# EAGLE design Esquematico (EAGLE 9.6.2)
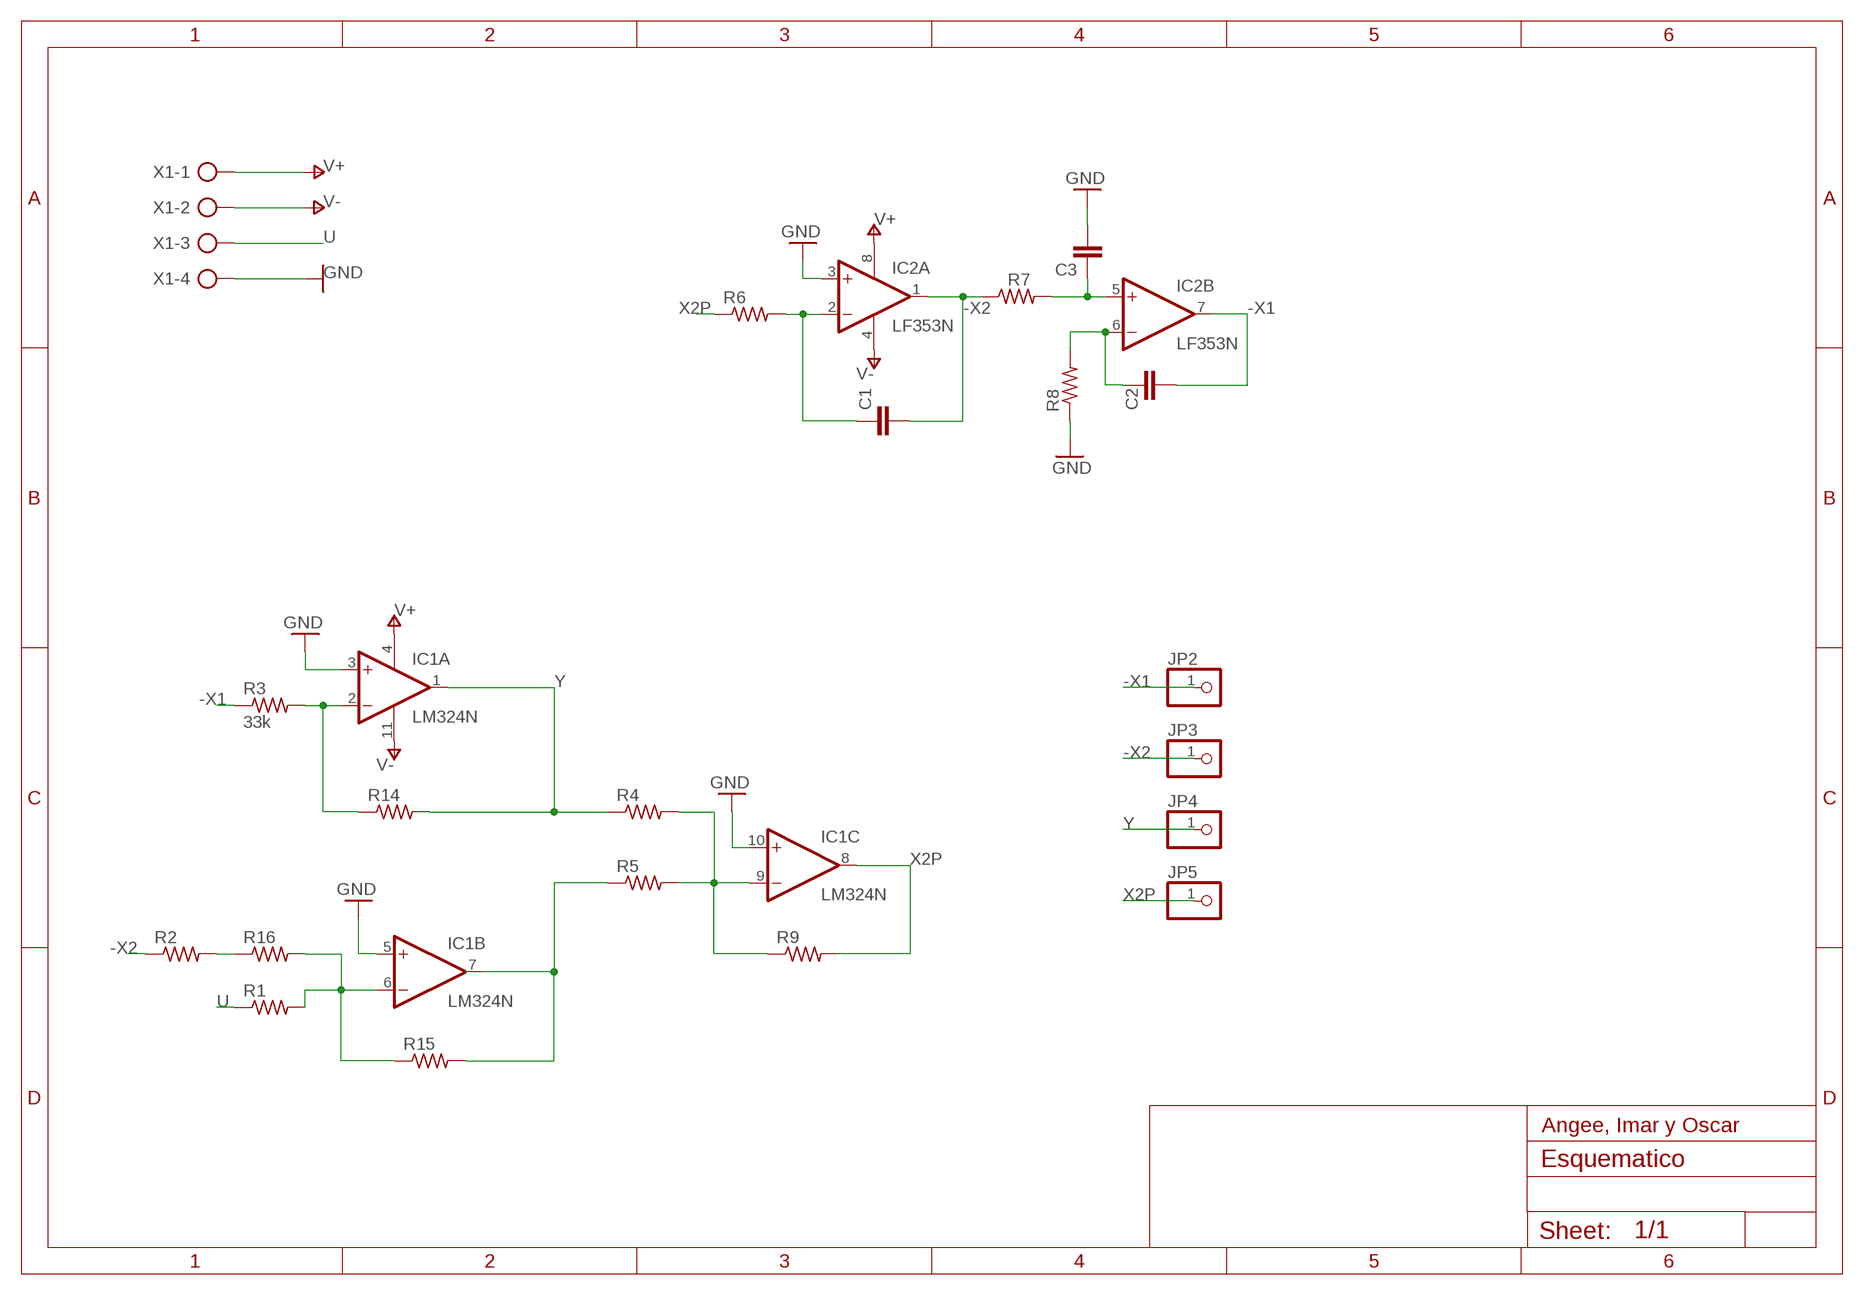
[diagram p0: schematic, sheet 1]

## Parts
C1  C-EU150-054X183  [C150-054X183]
C2  C-EU150-054X183  [C150-054X183]
C3  C-EU150-054X183  [C150-054X183]
IC1  LM324N  [DIL14]
IC2  LF353N  [DIL08]
JP2  PINHD-1X1  [1X01]
JP3  PINHD-1X1  [1X01]
JP4  PINHD-1X1  [1X01]
JP5  PINHD-1X1  [1X01]
R1  R-US_0204/7  [0204/7]
R2  R-US_0204/7  [0204/7]
R3  33k  R-US_0204/7  [0204/7]
R4  R-US_0204/7  [0204/7]
R5  R-US_0204/7  [0204/7]
R6  R-US_0204/7  [0204/7]
R7  R-US_0204/7  [0204/7]
R8  R-US_0204/7  [0204/7]
R9  R-US_0204/7  [0204/7]
R14  R-US_0204/7  [0204/7]
R15  R-US_0204/7  [0204/7]
R16  R-US_0204/7  [0204/7]
X1  AK300/4  [AK300/4]

## Nets
-X1: C2.2 IC2.7(B:OUT) JP2.1 R3.1
-X2: C1.2 IC2.1(A:OUT) JP3.1 R2.1 R7.1
GND: C3.2 IC1.3(A:+IN) IC1.5(B:+IN) IC1.10(C:+IN) IC2.3(A:+IN) R8.1 X1.4
N$1: R2.2 R16.1
N$2: C1.1 IC2.2(A:-IN) R6.2
N$4: C2.1 IC2.6(B:-IN) R8.2
N$6: C3.1 IC2.5(B:+IN) R7.2
N$7: IC1.6(B:-IN) R1.2 R15.1 R16.2
N$10: IC1.2(A:-IN) R3.2 R14.1
N$13: IC1.7(B:OUT) R5.1 R15.2
N$14: IC1.9(C:-IN) R4.2 R5.2 R9.1
U: R1.1 X1.3
V+: IC1.4(P:V+) IC2.8(P:V+) X1.1
V-: IC1.11(P:V-) IC2.4(P:V-) X1.2
X2P: IC1.8(C:OUT) JP5.1 R6.1 R9.2
Y: IC1.1(A:OUT) JP4.1 R4.1 R14.2
Unconnected: IC1.12(D:+IN) IC1.13(D:-IN) IC1.14(D:OUT)

## Notes on the sheet
- Angee, Imar y Oscar

## Library data of the parts
C1-C3 = rcl:C-EU: CAPACITOR, European symbol; SPICEPREFIX: C
IC1 = linear:LM324: OP AMP
IC2 = linear:LF353: OP AMP
JP2-JP5 = pinhead:PINHD-1X1: PIN HEADER
R1-R9 R14-R16 = rcl:R-US_: RESISTOR, American symbol; SPICEPREFIX: R
X1 = con-ptr500:AK300/4: CONNECTOR; OC_FARNELL: unknown; OC_NEWARK: unknown

## Board
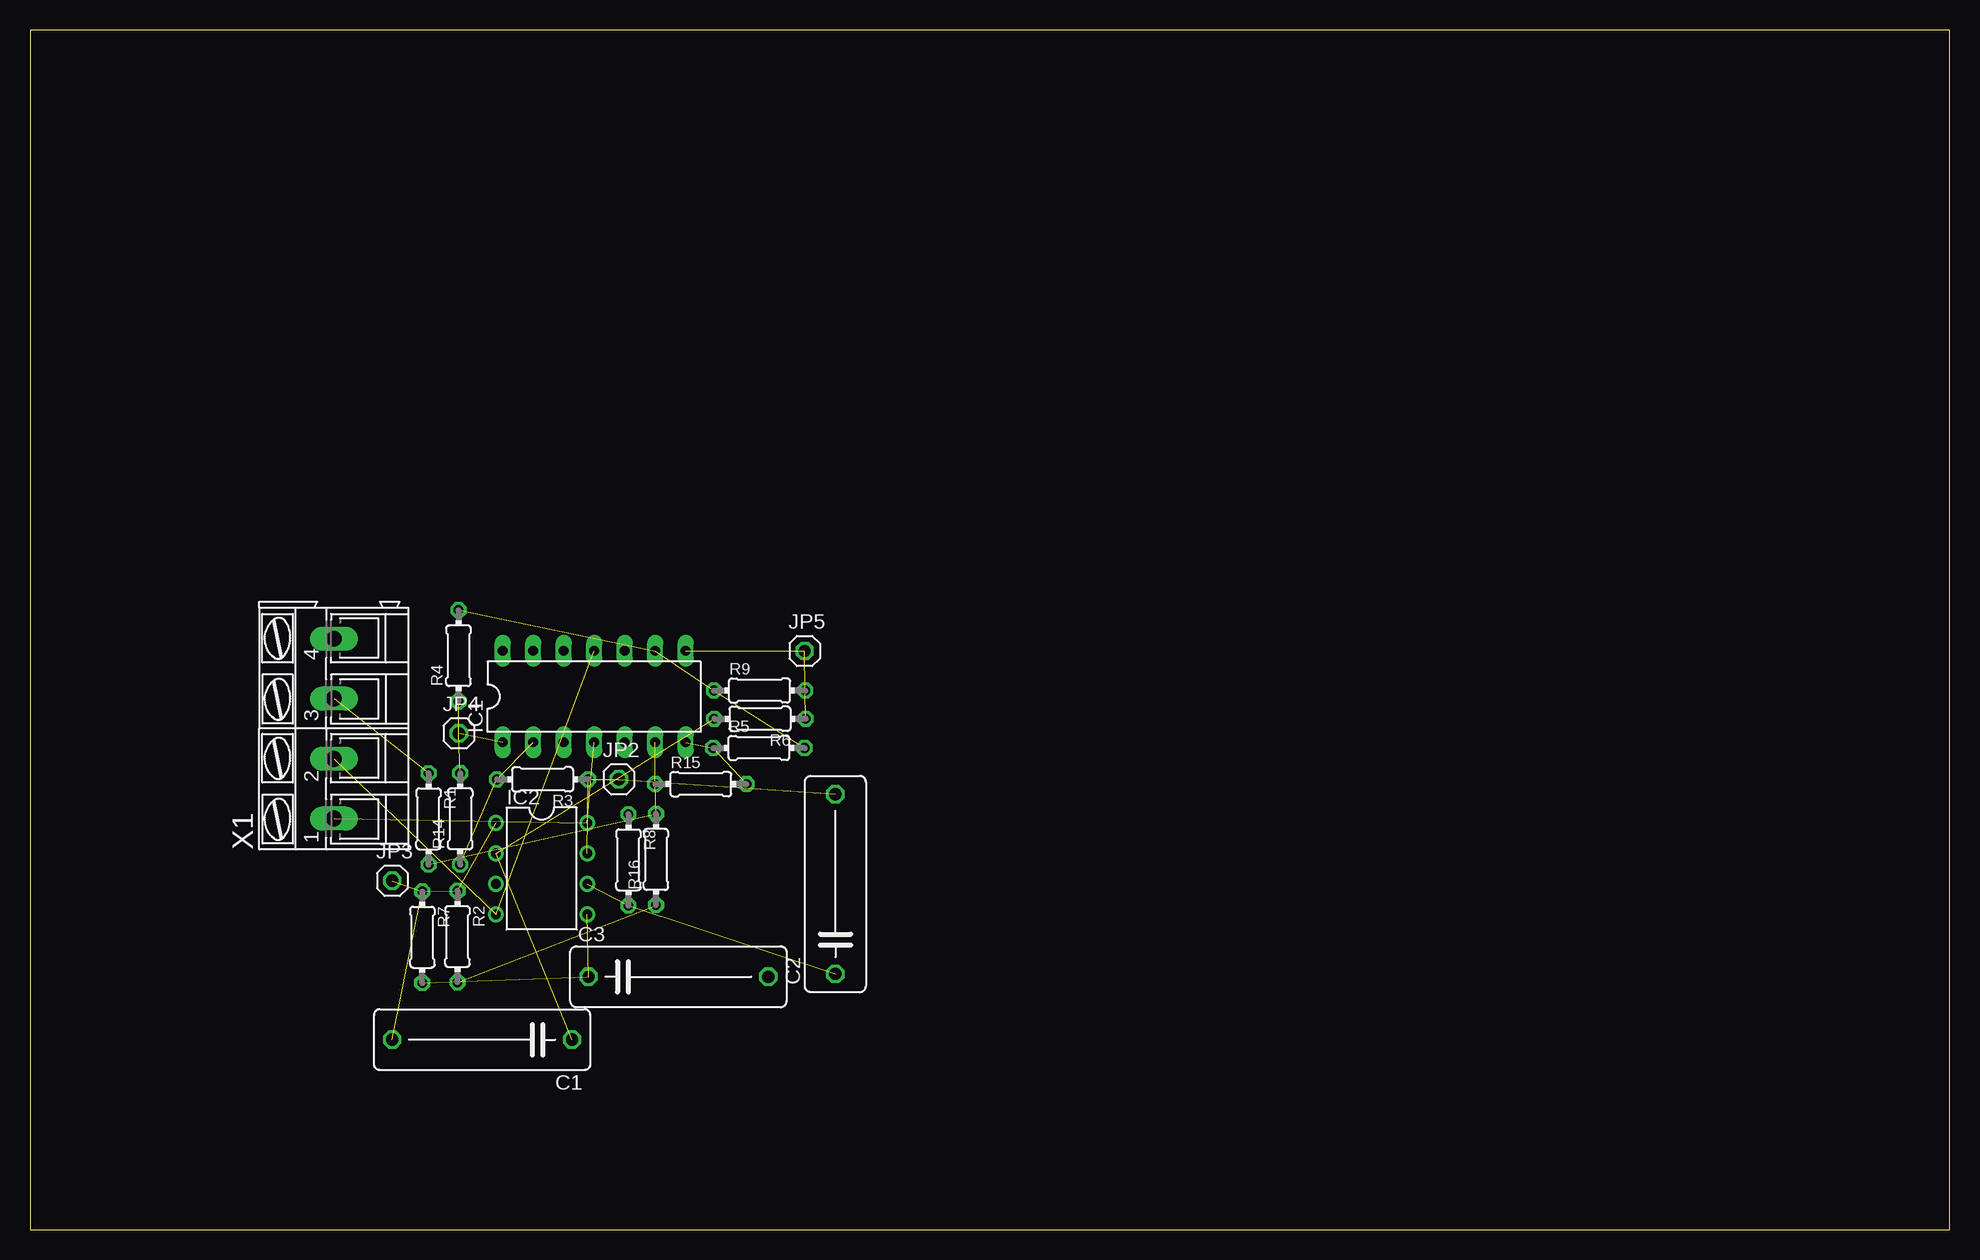
[diagram p1: board, top side]
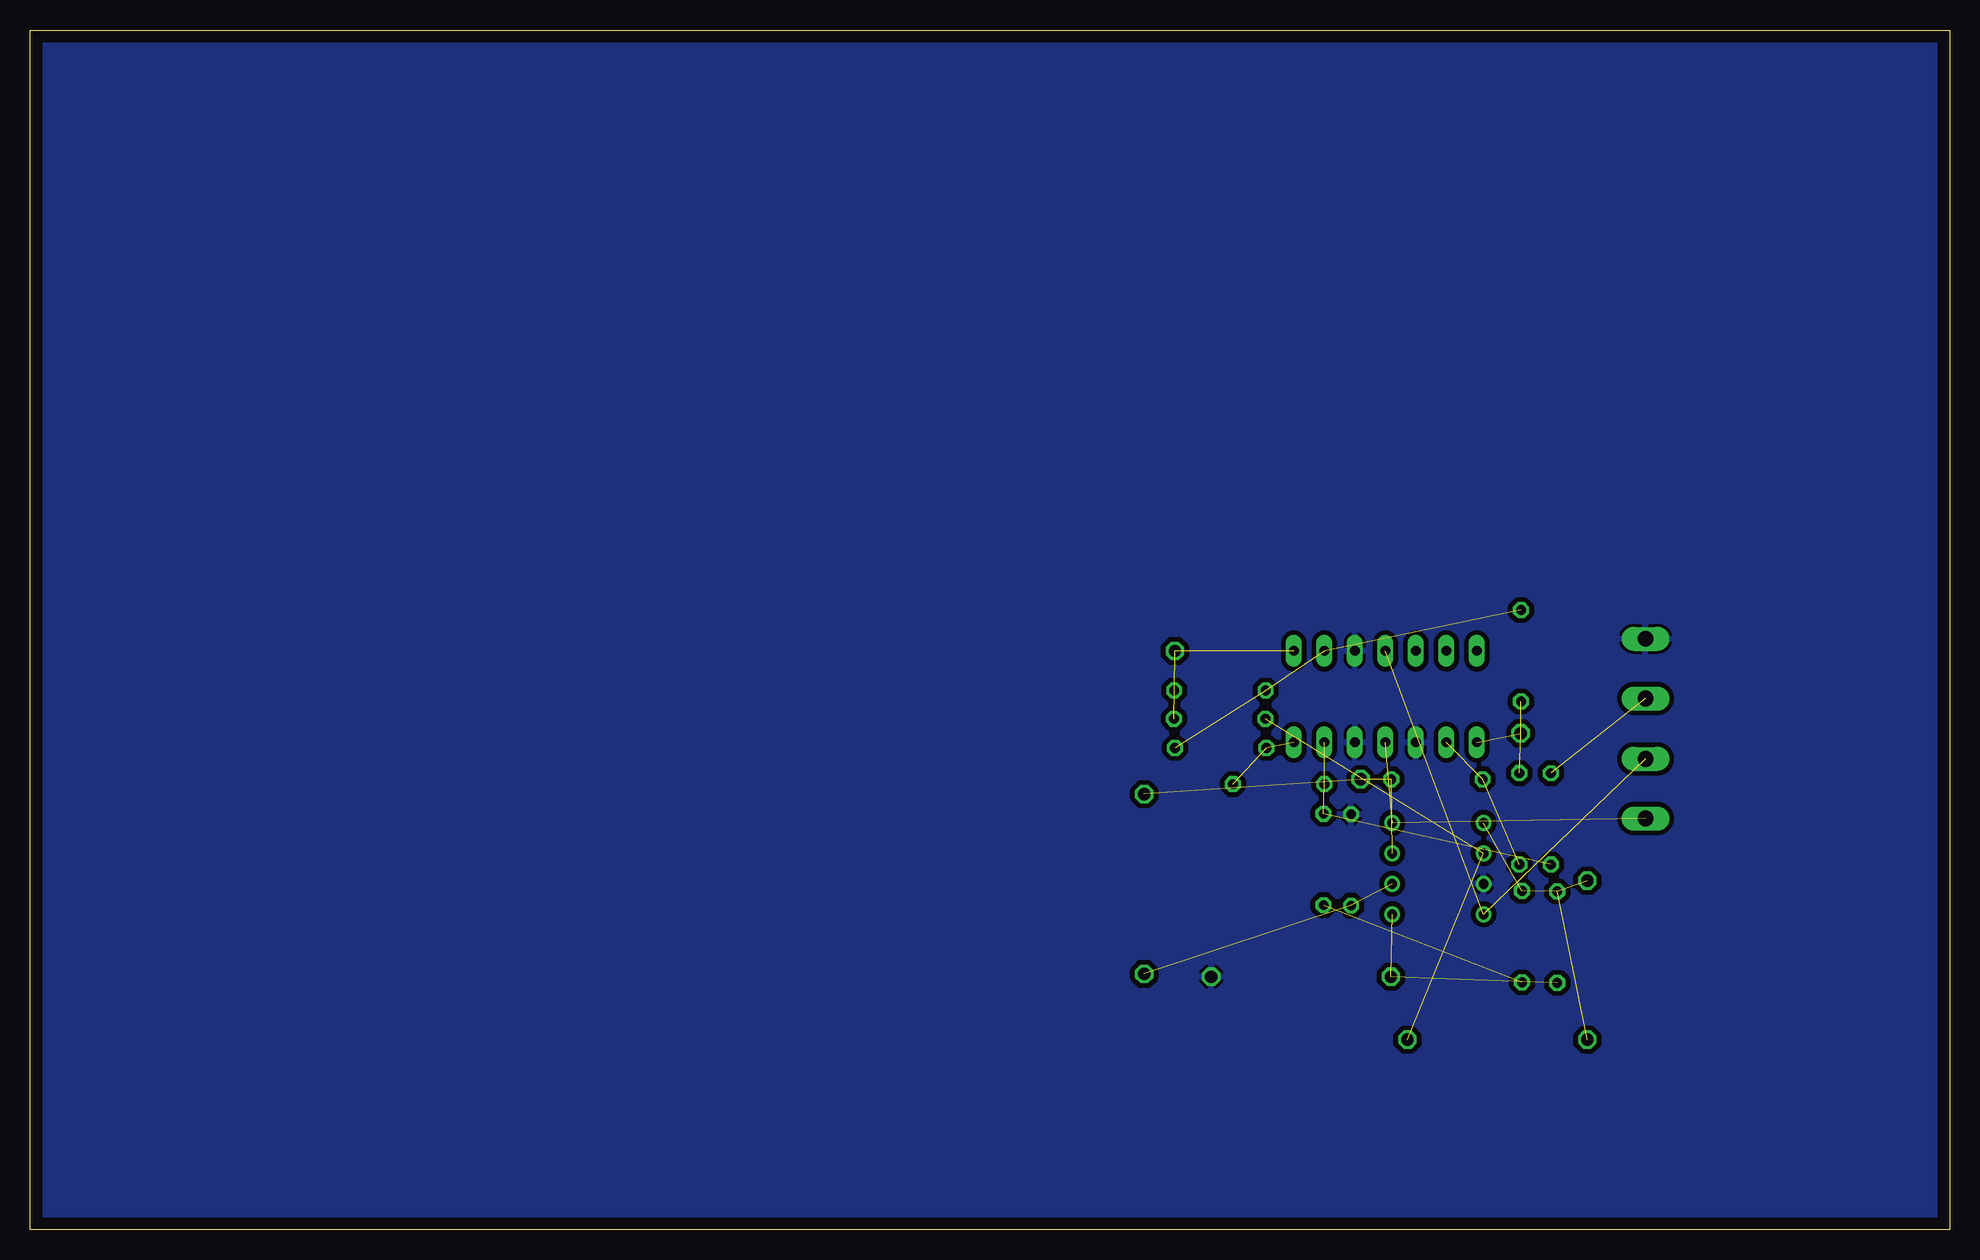
[diagram p2: board, bottom side, seen from below]

Size 160 x 100 mm. Coordinates in mm from the lower left corner, seen from the top.
Outline: 0,0 160,0 160,100 0,100 0,0
Copper layers (1*16): Top 0.035mm / dielectric 1.5mm / Bottom 0.035mm
Design rules "default *": minimum track width 20mil, minimum drill 0.35mm, track to track 16mil, track to pad 16mil, pad to pad 6mil, via to via 6mil, smd to smd 6mil, copper to edge 40mil, drill to drill 6mil, minimum pad ring 10mil, minimum via ring 8mil, stop-mask expansion 4mil, vias tented up to drill 0mil, thermal gap 10mil

### Footprints (pad centres in the part's own frame; a part is rotated, then mirrored left to right if it is on the bottom)
C150-054X183 = drill 1.016 octagon: 1 -7.493,0; 2 7.493,0
DIL14 = drill 0.813 long: 1 -7.62,-3.81; 2 -5.08,-3.81; 3 -2.54,-3.81; 4 0,-3.81; 5 2.54,-3.81; 6 5.08,-3.81; 7 7.62,-3.81; 8 7.62,3.81; 9 5.08,3.81; 10 2.54,3.81; 11 0,3.81; 12 -2.54,3.81; 13 -5.08,3.81; 14 -7.62,3.81
DIL08 = drill 0.813 pad 1.27: 1 -3.81,-3.81; 2 -1.27,-3.81; 3 1.27,-3.81; 4 3.81,-3.81; 5 3.81,3.81; 6 1.27,3.81; 7 -1.27,3.81; 8 -3.81,3.81
1X01 = drill 1.016 octagon: 1 0,0
0204/7 = drill 0.813 octagon: 1 -3.81,0; 2 3.81,0
AK300/4 = drill 1.321 long: 1 -7.493,0; 2 -2.515,0; 3 2.515,0; 4 7.493,0

### Placement (x,y rotation side)
C1  37.69,15.83 180 top
C2  67.13,28.8 90 top
C3  54.05,21.07 0 top
IC1  47.03,44.43 0 top
IC2  42.65,30.09 270 top
JP2  49.08,37.53 0 top
JP3  30.2,29.08 0 top
JP4  35.75,41.37 0 top
JP5  64.57,48.23 0 top
R1  33.22,34.24 270 top
R2  35.63,24.42 270 top
R3  42.72,37.53 180 top
R4  35.72,47.83 90 top
R5  60.75,40.15 0 top
R6  60.84,42.57 180 top
R7  32.7,24.37 270 top
R8  49.88,30.81 270 top
R9  60.81,44.94 0 top
R14  35.86,34.24 90 top
R15  55.92,37.13 0 top
R16  52.17,30.85 90 top
X1  25.34,41.76 90 top

### Tracks (layer width: path | path; a pad name or v marks a point on that pad's centre or on a via)
-X1  (3 unrouted)
-X2  (4 unrouted)
GND
  pour Bottom: 160,0 0,0 0,100 160,100
N$1  (1 unrouted)
N$2  (2 unrouted)
N$4  (2 unrouted)
N$6  (2 unrouted)
N$7  (3 unrouted)
N$10  (2 unrouted)
N$13  (2 unrouted)
N$14  (3 unrouted)
U  (1 unrouted)
V+  (2 unrouted)
V-  (2 unrouted)
X2P  (3 unrouted)
Y  (3 unrouted)